# Altium schematic sheet Day.SchDoc
size A4; SheetNumber: 1; SheetTotal: 3
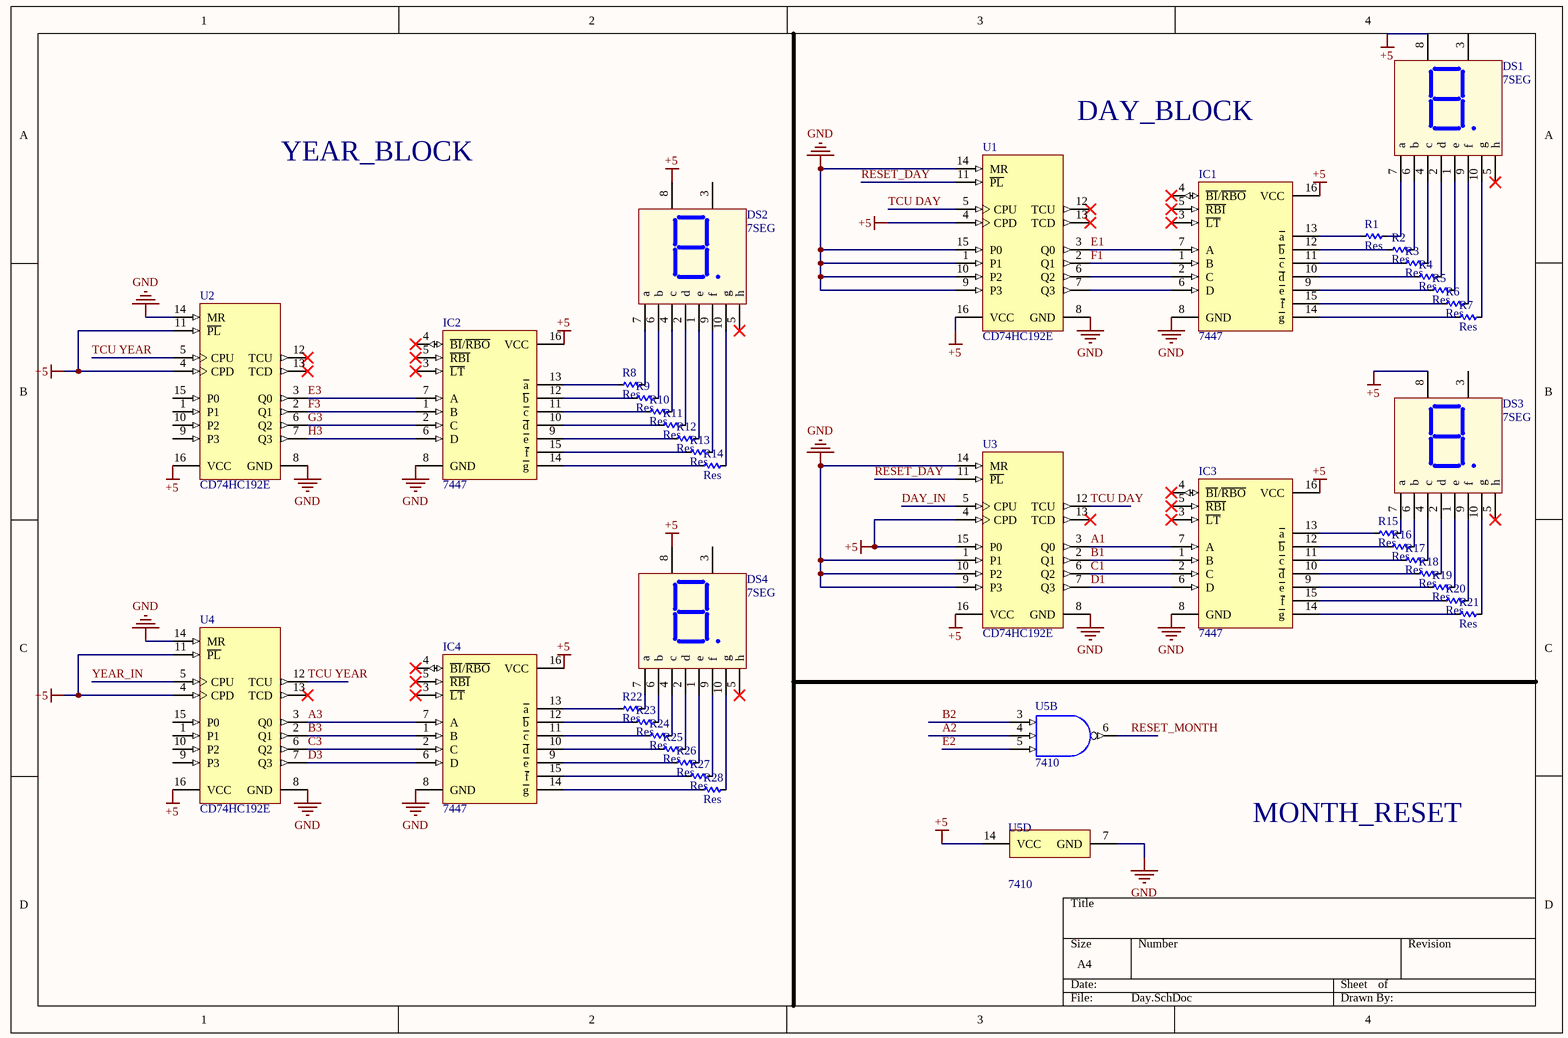
[diagram p0: Day.SchDoc]

## Parts
DS1  7SEG  [LED7SEG-1-0.56]
DS2  7SEG  [LED7SEG-1-0.56]
DS3  7SEG  [LED7SEG-1-0.56]
DS4  7SEG  [LED7SEG-1-0.56]
IC1  7447  [DIP16]
IC2  7447  [DIP16]
IC3  7447  [DIP16]
IC4  7447  [DIP16]
R1  Res  [RES-1/4W]
R2  Res  [RES-1/4W]
R3  Res  [RES-1/4W]
R4  Res  [RES-1/4W]
R5  Res  [RES-1/4W]
R6  Res  [RES-1/4W]
R7  Res  [RES-1/4W]
R8  Res  [RES-1/4W]
R9  Res  [RES-1/4W]
R10  Res  [RES-1/4W]
R11  Res  [RES-1/4W]
R12  Res  [RES-1/4W]
R13  Res  [RES-1/4W]
R14  Res  [RES-1/4W]
R15  Res  [RES-1/4W]
R16  Res  [RES-1/4W]
R17  Res  [RES-1/4W]
R18  Res  [RES-1/4W]
R19  Res  [RES-1/4W]
R20  Res  [RES-1/4W]
R21  Res  [RES-1/4W]
R22  Res  [RES-1/4W]
R23  Res  [RES-1/4W]
R24  Res  [RES-1/4W]
R25  Res  [RES-1/4W]
R26  Res  [RES-1/4W]
R27  Res  [RES-1/4W]
R28  Res  [RES-1/4W]
U1  CD74HC192E  [N0016A]
U2  CD74HC192E  [N0016A]
U3  CD74HC192E  [N0016A]
U4  CD74HC192E  [N0016A]
U5  7410  [N0014A]  (parts B,D of 4)

## Nets
+5: DS1.8(Vcc) DS2.8(Vcc) DS3.8(Vcc) DS4.8(Vcc) IC1.16(VCC) IC2.16(VCC) IC3.16(VCC) IC4.16(VCC) U1.4(CPD) U1.16(VCC) U2.4(CPD) U2.11(~{PL}) U2.16(VCC) U3.4(CPD) U3.15(P0) U3.16(VCC) U4.4(CPD) U4.11(~{PL}) U4.16(VCC) U5.14(VCC)
GND: IC1.8(GND) IC2.8(GND) IC3.8(GND) IC4.8(GND) U1.1(P1) U1.8(GND) U1.9(P3) U1.10(P2) U1.14(MR) U1.15(P0) U2.8(GND) U2.14(MR) U3.1(P1) U3.8(GND) U3.9(P3) U3.10(P2) U3.14(MR) U4.8(GND) U4.14(MR) U5.7(GND)
A1: IC3.7(A) U3.3(Q0)
A2: U5.4(2B)
A3: IC4.7(A) U4.3(Q0)
B1: IC3.1(B) U3.2(Q1)
B2: U5.3(2A)
B3: IC4.1(B) U4.2(Q1)
C1: IC3.2(C) U3.6(Q2)
C3: IC4.2(C) U4.6(Q2)
D1: IC3.6(D) U3.7(Q3)
D3: IC4.6(D) U4.7(Q3)
DAY_IN: U3.5(CPU)
E1: IC1.7(A) U1.3(Q0)
E2: U5.5(2C)
E3: IC2.7(A) U2.3(Q0)
F1: IC1.1(B) U1.2(Q1)
F3: IC2.1(B) U2.2(Q1)
G3: IC2.2(C) U2.6(Q2)
H3: IC2.6(D) U2.7(Q3)
RESET_DAY: U1.11(~{PL}) U3.11(~{PL})
RESET_MONTH: U5.6(2Y)
TCU DAY: U1.5(CPU) U3.12(TCU)
TCU YEAR: U2.5(CPU) U4.12(TCU)
YEAR_IN: U4.5(CPU)
NetDS1_1: DS1.1(e) R5.1
NetDS1_2: DS1.2(d) R4.1
NetDS1_4: DS1.4(c) R3.1
NetDS1_6: DS1.6(b) R2.1
NetDS1_7: DS1.7(a) R1.1
NetDS1_9: DS1.9(f) R6.1
NetDS1_10: DS1.10(g) R7.1
NetDS2_1: DS2.1(e) R12.1
NetDS2_2: DS2.2(d) R11.1
NetDS2_4: DS2.4(c) R10.1
NetDS2_6: DS2.6(b) R9.1
NetDS2_7: DS2.7(a) R8.1
NetDS2_9: DS2.9(f) R13.1
NetDS2_10: DS2.10(g) R14.1
NetDS3_1: DS3.1(e) R19.1
NetDS3_2: DS3.2(d) R18.1
NetDS3_4: DS3.4(c) R17.1
NetDS3_6: DS3.6(b) R16.1
NetDS3_7: DS3.7(a) R15.1
NetDS3_9: DS3.9(f) R20.1
NetDS3_10: DS3.10(g) R21.1
NetDS4_1: DS4.1(e) R26.1
NetDS4_2: DS4.2(d) R25.1
NetDS4_4: DS4.4(c) R24.1
NetDS4_6: DS4.6(b) R23.1
NetDS4_7: DS4.7(a) R22.1
NetDS4_9: DS4.9(f) R27.1
NetDS4_10: DS4.10(g) R28.1
NetIC1_2: IC1.2(C) U1.6(Q2)
NetIC1_6: IC1.6(D) U1.7(Q3)
NetIC1_9: IC1.9(~{e}) R5.2
NetIC1_10: IC1.10(~{d}) R4.2
NetIC1_11: IC1.11(~{c}) R3.2
NetIC1_12: IC1.12(~{b}) R2.2
NetIC1_13: IC1.13(~{a}) R1.2
NetIC1_14: IC1.14(~{g}) R7.2
NetIC1_15: IC1.15(~{f}) R6.2
NetIC2_9: IC2.9(~{e}) R12.2
NetIC2_10: IC2.10(~{d}) R11.2
NetIC2_11: IC2.11(~{c}) R10.2
NetIC2_12: IC2.12(~{b}) R9.2
NetIC2_13: IC2.13(~{a}) R8.2
NetIC2_14: IC2.14(~{g}) R14.2
NetIC2_15: IC2.15(~{f}) R13.2
NetIC3_9: IC3.9(~{e}) R19.2
NetIC3_10: IC3.10(~{d}) R18.2
NetIC3_11: IC3.11(~{c}) R17.2
NetIC3_12: IC3.12(~{b}) R16.2
NetIC3_13: IC3.13(~{a}) R15.2
NetIC3_14: IC3.14(~{g}) R21.2
NetIC3_15: IC3.15(~{f}) R20.2
NetIC4_9: IC4.9(~{e}) R26.2
NetIC4_10: IC4.10(~{d}) R25.2
NetIC4_11: IC4.11(~{c}) R24.2
NetIC4_12: IC4.12(~{b}) R23.2
NetIC4_13: IC4.13(~{a}) R22.2
NetIC4_14: IC4.14(~{g}) R28.2
NetIC4_15: IC4.15(~{f}) R27.2

Not connected (* = marked no-connect by the designer): DS1 3(Vcc) 5(h)*; DS2 3(Vcc) 5(h)*; DS3 3(Vcc) 5(h)*; DS4 3(Vcc) 5(h)*; IC1 3(~{LT})* 4(~{BI}/~{RBO})* 5(~{RBI})*; IC2 3(~{LT})* 4(~{BI}/~{RBO})* 5(~{RBI})*; IC3 3(~{LT})* 4(~{BI}/~{RBO})* 5(~{RBI})*; IC4 3(~{LT})* 4(~{BI}/~{RBO})* 5(~{RBI})*; U1 12(TCU)* 13(TCD)*; U2 1(P1) 9(P3) 10(P2) 12(TCU)* 13(TCD)* 15(P0); U3 13(TCD)*; U4 1(P1) 9(P3) 10(P2) 13(TCD)* 15(P0)

## Notes on the sheet
- YEAR_BLOCK
- DAY_BLOCK
- MONTH_RESET

## Library data of the parts
DS1-DS4 = LED7SEG-1: 14.2 mm General Purpose Blue 7-Segment Display: CC, RH DP, Gray Surface; MinimumIntensity: 2020 ucd; Note: IF = 10 mA; Published: 8-Jun-2000; LatestRevisionDate: 17-Dec-2003; LatestRevisionNote: Schematic revised, PCB Footprint replaced.; DatasheetDocument: 24-Sep-2002; PackageDocument: 24-Sep-2002; PackageReference: H; Publisher: Altium Limited; Colour: Blue; ComponentLink1Description: Manufacturer Link; ComponentLink1URL: http://www.agilent.com/
IC1-IC4 = 7447: BCD to 7-Segment Decoder/Driver; Value: 7447 , 74247
R1-R28 = Res: Manufacturer: Generic Components; Class: Passive; SubClass: R; Published: 08/06/2000; Publisher: Altium Hobart Technology Centre
U1-U4 = 74192: High Speed CMOS Logic Presettable Synchronous BCD Decade Up/Down Counter with Asynchronous Reset, N0016A, TUBE; Manufacturer: Texas Instruments; Output Drive (IOL/IOH)(Max)(mA): 5.2/-5.2; Inputs: 1; VCC(Min)(V): 2; ICC @ Nom Voltage(Max)(mA): 0.08; Input Type: LVTTL/CMOS; Technology Family: HC; F @ Nom Voltage(Max)(Mhz): 28; VCC(Max)(V): 6; Bits(#): 4; Rating: Catalog; tpd @ Nom Voltage(Max)(ns): 46; Voltage(Nom)(V): 3.3,5; Schmitt Trigger: No; PackageReference: N0016A; Code_JEDEC: MS-001; Generic Part Number: CD74HC192; Type: Decade; DatasheetVersion: SCHS163F; Operating Temperature Range(C): -55 to 125; Function: Counter; Output Type: CMOS
U5 = 7410: Triple 3-input positive-NAND gates, N0014A, TUBE; Manufacturer: Texas Instruments; Generic Part Number: SN74F10; Input Type: TTL; F @ Nom Voltage(Max)(Mhz): 70; Schmitt Trigger: No; tpd @ Nom Voltage(Max)(ns): 6; Bits(#): 3; Rating: Catalog; VCC(Max)(V): 5.5; ICC @ Nom Voltage(Max)(mA): 0.0077; Output Drive (IOL/IOH)(Max)(mA): 1/-20; Technology Family: F; VCC(Min)(V): 4.5; Voltage(Nom)(V): 5; DatasheetVersion: SDFS039A; Output Type: TTL; Code_JEDEC: MS-001; Operating Temperature Range(C): 0 to 70; PackageReference: N0014A